# Altium schematic sheet SIMCOM-A7670C.SchDoc
size A3; SheetNumber: 3; SheetTotal: 5
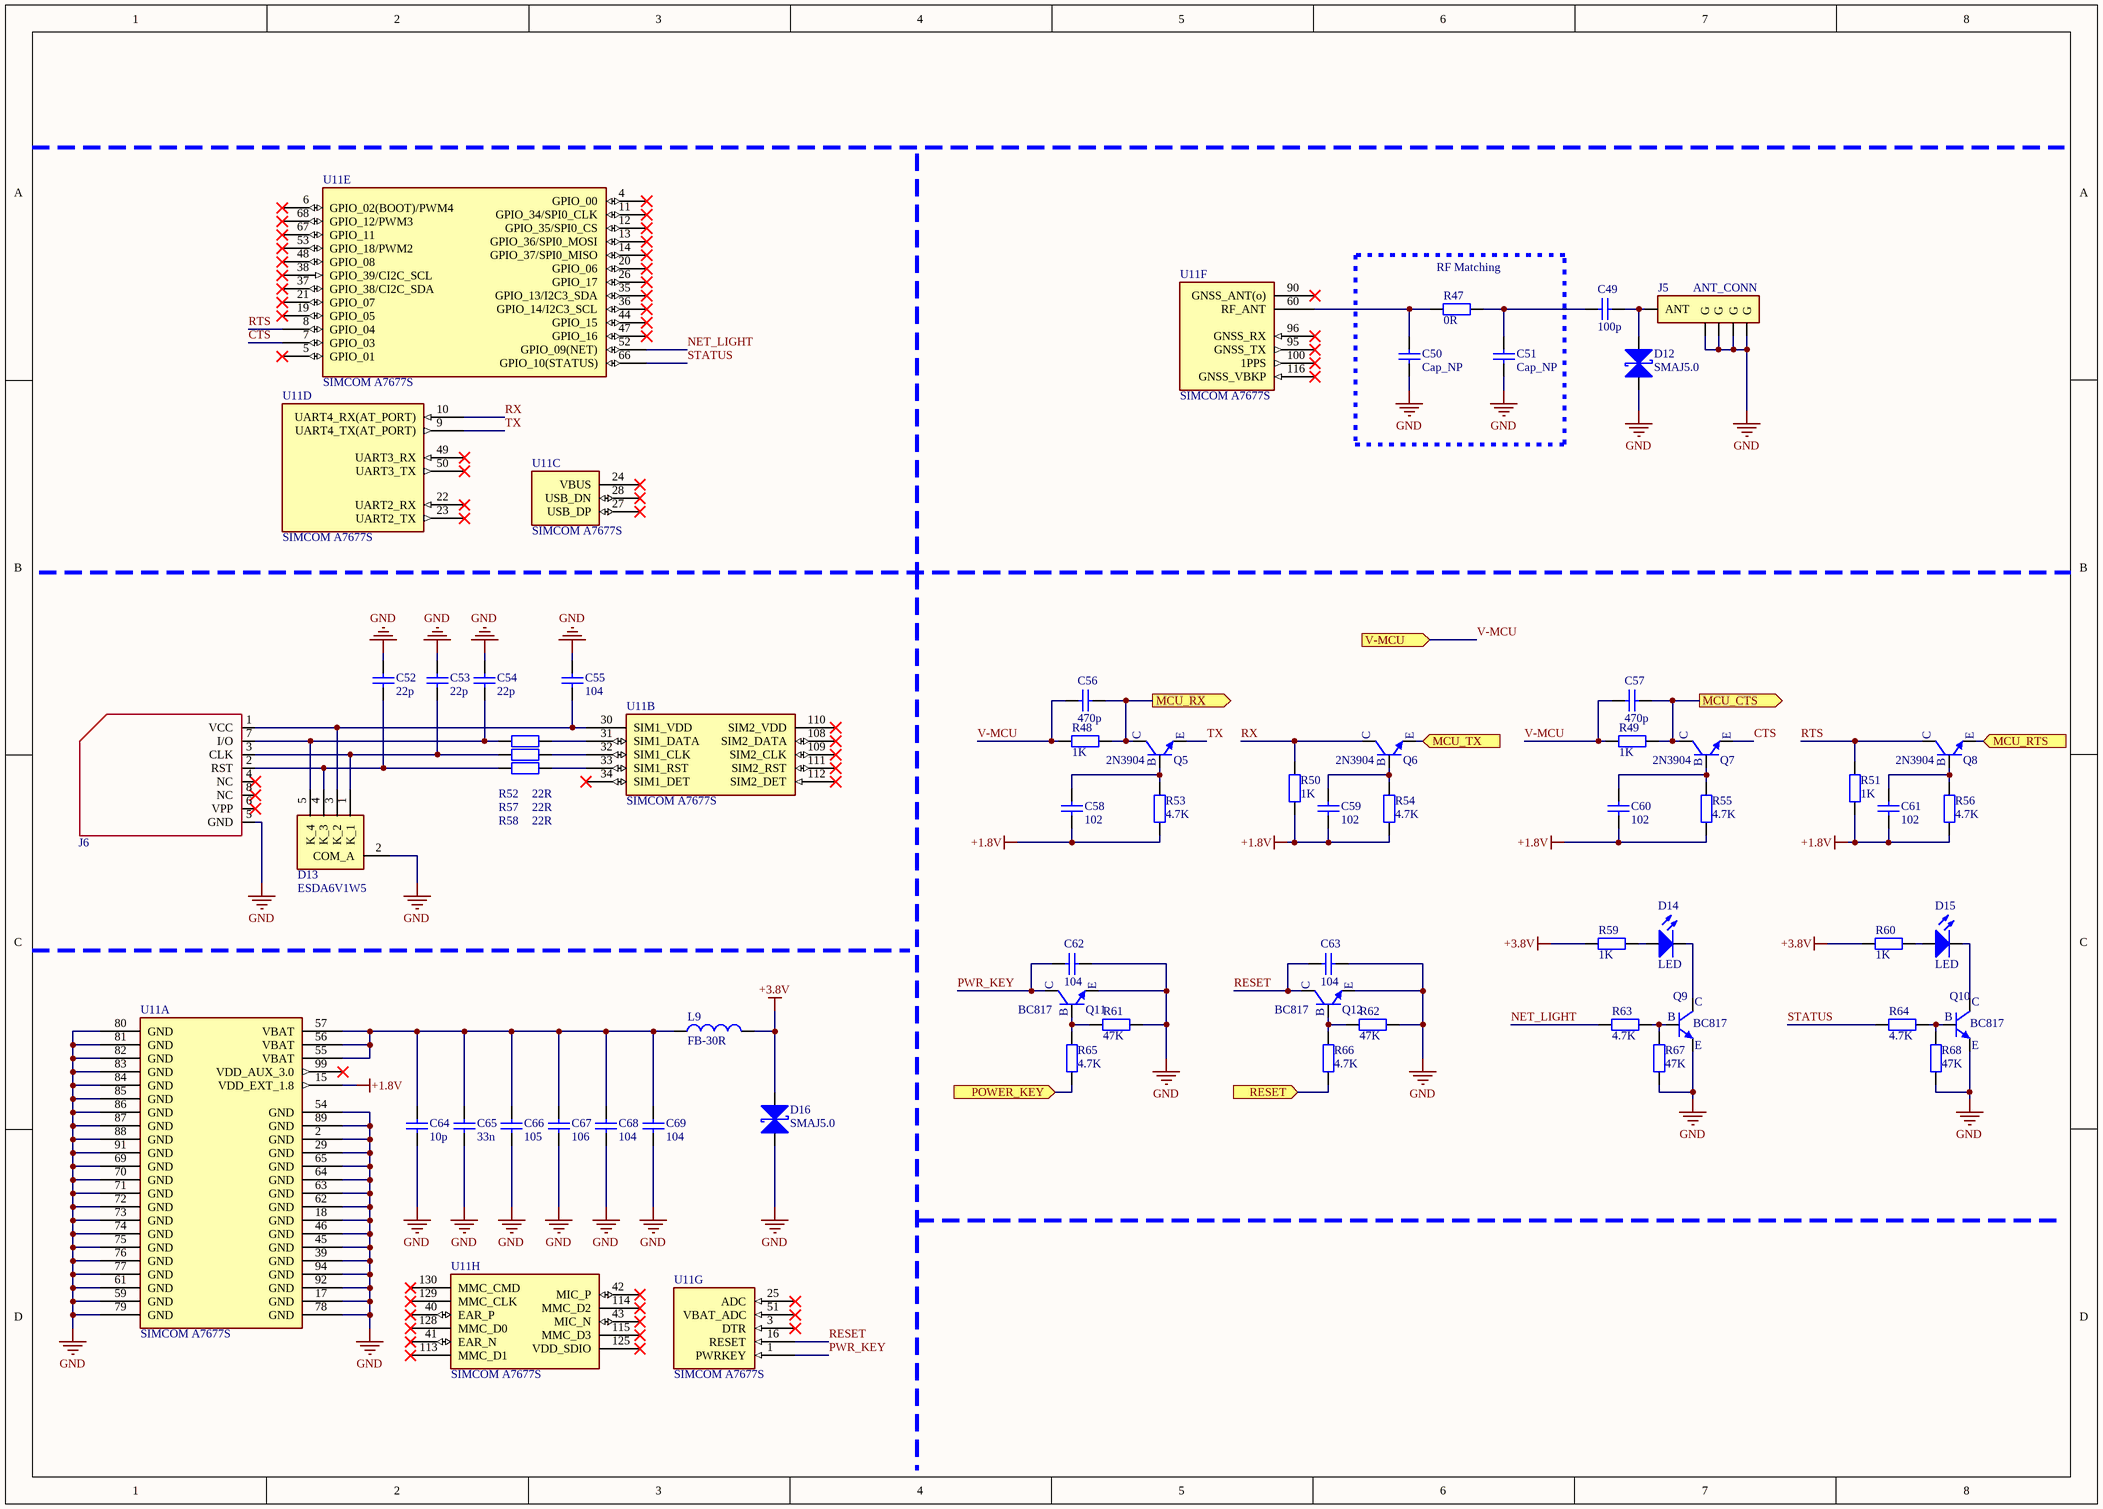
[diagram p0: SIMCOM-A7670C.SchDoc]

## Parts
C49  100p  [CAP_0603]
C50  Cap_NP  [CAP_0603]
C51  Cap_NP  [CAP_0603]
C52  22p  [CAP_0603]
C53  22p  [CAP_0603]
C54  22p  [CAP_0603]
C55  104  [CAP_0603]
C56  470p  [CAP_0603]
C57  470p  [CAP_0603]
C58  102  [CAP_0603]
C59  102  [CAP_0603]
C60  102  [CAP_0603]
C61  102  [CAP_0603]
C62  104  [CAP_0603]
C63  104  [CAP_0603]
C64  10p  [CAP_0805]
C65  33n  [CAP_0805]
C66  105  [CAP_0805]
C67  106  [CAP_0805]
C68  104  [CAP_0805]
C69  104  [CAP_0805]
D12  SMAJ5.0  [SMA]
D13  ESDA6V1W5  [SOT65P210X110-5N]
D14  LED  [LED-0805-Red]
D15  LED  [LED-0805-Red]
D16  SMAJ5.0  [SMA]
J5  ANT_CONN  [SMA_RAM_15]
J6  MicroSimcard  [MICRO SIM SOCKET]  (value not drawn)
L9  FB-30R  [INDC-0805]
Q5  2N3904  [SOT-23]
Q6  2N3904  [SOT-23]
Q7  2N3904  [SOT-23]
Q8  2N3904  [SOT-23]
Q9  BC817  [SOT-23]
Q10  BC817  [SOT-23]
Q11  BC817  [SOT-23]
Q12  BC817  [SOT-23]
R47  0R  [RES_0603]
R48  1K  [RES_0603]
R49  1K  [RES_0603]
R50  1K  [RES_0603]
R51  1K  [RES_0603]
R52  22R  [RES_0603]
R53  4.7K  [RES_0603]
R54  4.7K  [RES_0603]
R55  4.7K  [RES_0603]
R56  4.7K  [RES_0603]
R57  22R  [RES_0603]
R58  22R  [RES_0603]
R59  1K  [RES_0603]
R60  1K  [RES_0603]
R61  47K  [RES_0603]
R62  47K  [RES_0603]
R63  4.7K  [RES_0603]
R64  4.7K  [RES_0603]
R65  4.7K  [RES_0603]
R66  4.7K  [RES_0603]
R67  47K  [RES_0603]
R68  47K  [RES_0603]
U11  SIMCOM A7677S  [SIMA7677S]  (parts A,B,C,D,E,F,G,H of 8)

## Blocks framed on the sheet
RF Matching: C50 C51 R47

## Ports
MCU_CTS (out), MCU_RTS (in), MCU_RX (out), MCU_TX (in), POWER_KEY (in), RESET (in), V-MCU (in)

## Nets
+1.8V: C58.1 C59.1 C60.1 C61.1 R50.1 R51.1 R53.1 R54.1 R55.1 R56.1 U11.15(VDD_EXT_1.8)
+3.8V: D16.2(A) L9.2 R59.2 R60.2
GND: C50.1 C51.1 C52.2 C53.2 C54.2 C55.2 C62.2 C63.2 C64.1 C65.1 C66.1 C67.1 C68.1 C69.1 D12.1(K) D13.2(COM_A) D16.1(K) J5.2(G) J5.3(G) J5.4(G) J5.5(G) J6.5(GND) Q9.3(E) Q10.3(E) Q11.3(E) Q12.3(E) R61.2 R62.2 R67.1 R68.1 U11.2(GND) U11.17(GND) U11.18(GND) U11.29(GND) U11.39(GND) U11.45(GND) U11.46(GND) U11.54(GND) U11.59(GND) U11.61(GND) U11.62(GND) U11.63(GND) U11.64(GND) U11.65(GND) U11.69(GND) U11.70(GND) U11.71(GND) U11.72(GND) U11.73(GND) U11.74(GND) U11.75(GND) U11.76(GND) U11.77(GND) U11.78(GND) U11.79(GND) U11.80(GND) U11.81(GND) U11.82(GND) U11.83(GND) U11.84(GND) U11.85(GND) U11.86(GND) U11.87(GND) U11.88(GND) U11.89(GND) U11.91(GND) U11.92(GND) U11.94(GND)
CTS: Q7.3(E) U11.7(GPIO_03)
MCU_CTS: C57.1 Q7.2(C) R49.1 ; port MCU_CTS
MCU_RTS: Q8.3(E) ; port MCU_RTS
MCU_RX: C56.1 Q5.2(C) R48.1 ; port MCU_RX
MCU_TX: Q6.3(E) ; port MCU_TX
NET_LIGHT: R63.2 U11.52(GPIO_09(NET))
POWER_KEY: R65.1 ; port POWER_KEY
PWR_KEY: C62.1 Q11.2(C) U11.1(PWRKEY)
RESET: C63.1 Q12.2(C) U11.16(RESET)
RESET: R66.1 ; port RESET  [a separate net that carries the same name]
RTS: Q8.2(C) R51.2 U11.8(GPIO_04)
RX: Q6.2(C) R50.2 U11.10(UART4_RX(AT_PORT))
STATUS: R64.2 U11.66(GPIO_10(STATUS))
TX: Q5.3(E) U11.9(UART4_TX(AT_PORT))
V-MCU: C56.2 C57.2 R48.2 R49.2 ; port V-MCU
NetC49_1: C49.1 D12.2(A) J5.1(ANT)
NetC49_2: C49.2 C51.2 R47.2
NetC50_2: C50.2 R47.1 U11.60(RF_ANT)
NetC52_1: C52.1 D13.4(K_3) J6.2(RST) R58.1
NetC53_1: C53.1 D13.1(K_1) J6.3(CLK) R57.1
NetC54_1: C54.1 D13.5(K_4) J6.7(I/O) R52.1
NetC55_1: C55.1 D13.3(K_2) J6.1(VCC) U11.30(SIM1_VDD)
NetC58_2: C58.2 Q5.1(B) R53.2
NetC59_2: C59.2 Q6.1(B) R54.2
NetC60_2: C60.2 Q7.1(B) R55.2
NetC61_2: C61.2 Q8.1(B) R56.2
NetC64_2: C64.2 C65.2 C66.2 C67.2 C68.2 C69.2 L9.1 U11.55(VBAT) U11.56(VBAT) U11.57(VBAT)
NetD14_1: D14.1(A) R59.1
NetD14_2: D14.2(K) Q9.2(C)
NetD15_1: D15.1(A) R60.1
NetD15_2: D15.2(K) Q10.2(C)
NetQ9_1: Q9.1(B) R63.1 R67.2
NetQ10_1: Q10.1(B) R64.1 R68.2
NetQ11_1: Q11.1(B) R61.1 R65.2
NetQ12_1: Q12.1(B) R62.1 R66.2
NetR52_2: R52.2 U11.31(SIM1_DATA)
NetR57_2: R57.2 U11.32(SIM1_CLK)
NetR58_2: R58.2 U11.33(SIM1_RST)

Not connected (* = marked no-connect by the designer): J6 4(NC)* 6(VPP)* 8(NC)*; U11 3(DTR)* 4(GPIO_00)* 5(GPIO_01)* 6(GPIO_02(BOOT)/PWM4)* 11(GPIO_34/SPI0_CLK)* 12(GPIO_35/SPI0_CS)* 13(GPIO_36/SPI0_MOSI)* 14(GPIO_37/SPI0_MISO)* 19(GPIO_05)* 20(GPIO_06)* 21(GPIO_07)* 22(UART2_RX)* 23(UART2_TX)* 24(VBUS)* 25(ADC)* 26(GPIO_17)* 27(USB_DP)* 28(USB_DN)* 34(SIM1_DET)* 35(GPIO_13/I2C3_SDA)* 36(GPIO_14/I2C3_SCL)* 37(GPIO_38/CI2C_SDA)* 38(GPIO_39/CI2C_SCL)* 40(EAR_P)* 41(EAR_N)* 42(MIC_P)* 43(MIC_N)* 44(GPIO_15)* 47(GPIO_16)* 48(GPIO_08)* 49(UART3_RX)* 50(UART3_TX)* 51(VBAT_ADC)* 53(GPIO_18/PWM2)* 58(GND) 67(GPIO_11)* 68(GPIO_12/PWM3)* 90(GNSS_ANT(o))* 95(GNSS_TX)* 96(GNSS_RX)* 99(VDD_AUX_3.0)* 100(1PPS)* 108(SIM2_DATA)* 109(SIM2_CLK)* 110(SIM2_VDD)* 111(SIM2_RST)* 112(SIM2_DET)* 113(MMC_D1)* 114(MMC_D2)* 115(MMC_D3)* 116(GNSS_VBKP)* 125(VDD_SDIO)* 128(MMC_D0)* 129(MMC_CLK)* 130(MMC_CMD)*

## Library data of the parts
C49-C69 = Cap_NP: Non-polarized capacitor
D12 D16 = TVS-Diode: TVS diode
D13 = ESDA6V1W5: Integrated Circuit; Manufacturer_Name: STMicroelectronics; Datasheet Link: http://www.st.com/st-web-ui/static/active/en/resource/technical/document/datasheet/CD00064033.pdf; Height: 1.1mm; Manufacturer_Part_Number: ESDA6V1W5; Mouser Part Number: 511-ESDA6V1W5; Mouser Price/Stock: https://www.mouser.co.uk/ProductDetail/STMicroelectronics/ESDA6V1W5?qs=9NrABl3fj%2FrhT5vdkOmqXg%3D%3D; Arrow Part Number: ESDA6V1W5; Arrow Price/Stock: https://www.arrow.com/en/products/esda6v1w5/stmicroelectronics?utm_currency=USD&region=nac
D14 D15 = LED: Light Emitting Diode
J5 = ANT_CONN: ATENNA PIN 1
J6 = MicroSimcard: Micro Simcard Socket
L9 = Inductor: Code_IEC: 1005; Published: 8-Jun-2000; LatestRevisionDate: 29-May-2009; LatestRevisionNote: IPC-7351 Footprint Added.; PackageReference: 0402-A; Publisher: Altium Limited; PackageDescription: Chip Inductor; Code_JEITA: 0402
Q5-Q12 = N-Trans
R47-R68 = Resistor